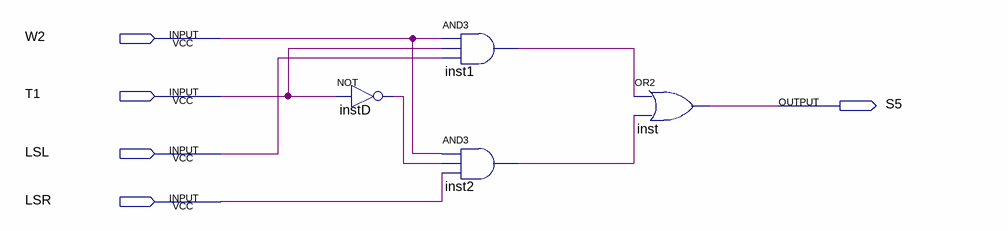
[diagram p0: schematic sheet]
// Quartus schematic S5.bdf as structural Verilog: 4 symbols, 5 pins
module S5 (
  input  W2,
  input  T1,
  input  LSL,
  input  LSR,
  output S5
);

  wire inst1_out, inst2_out, instD_out;

  not instD (instD_out, T1);
  and inst1 (inst1_out, W2, T1, LSL);
  and inst2 (inst2_out, W2, instD_out, LSR);
  or inst (S5, inst1_out, inst2_out);
endmodule
